# EAGLE design DRO (EAGLE 9.6.2)
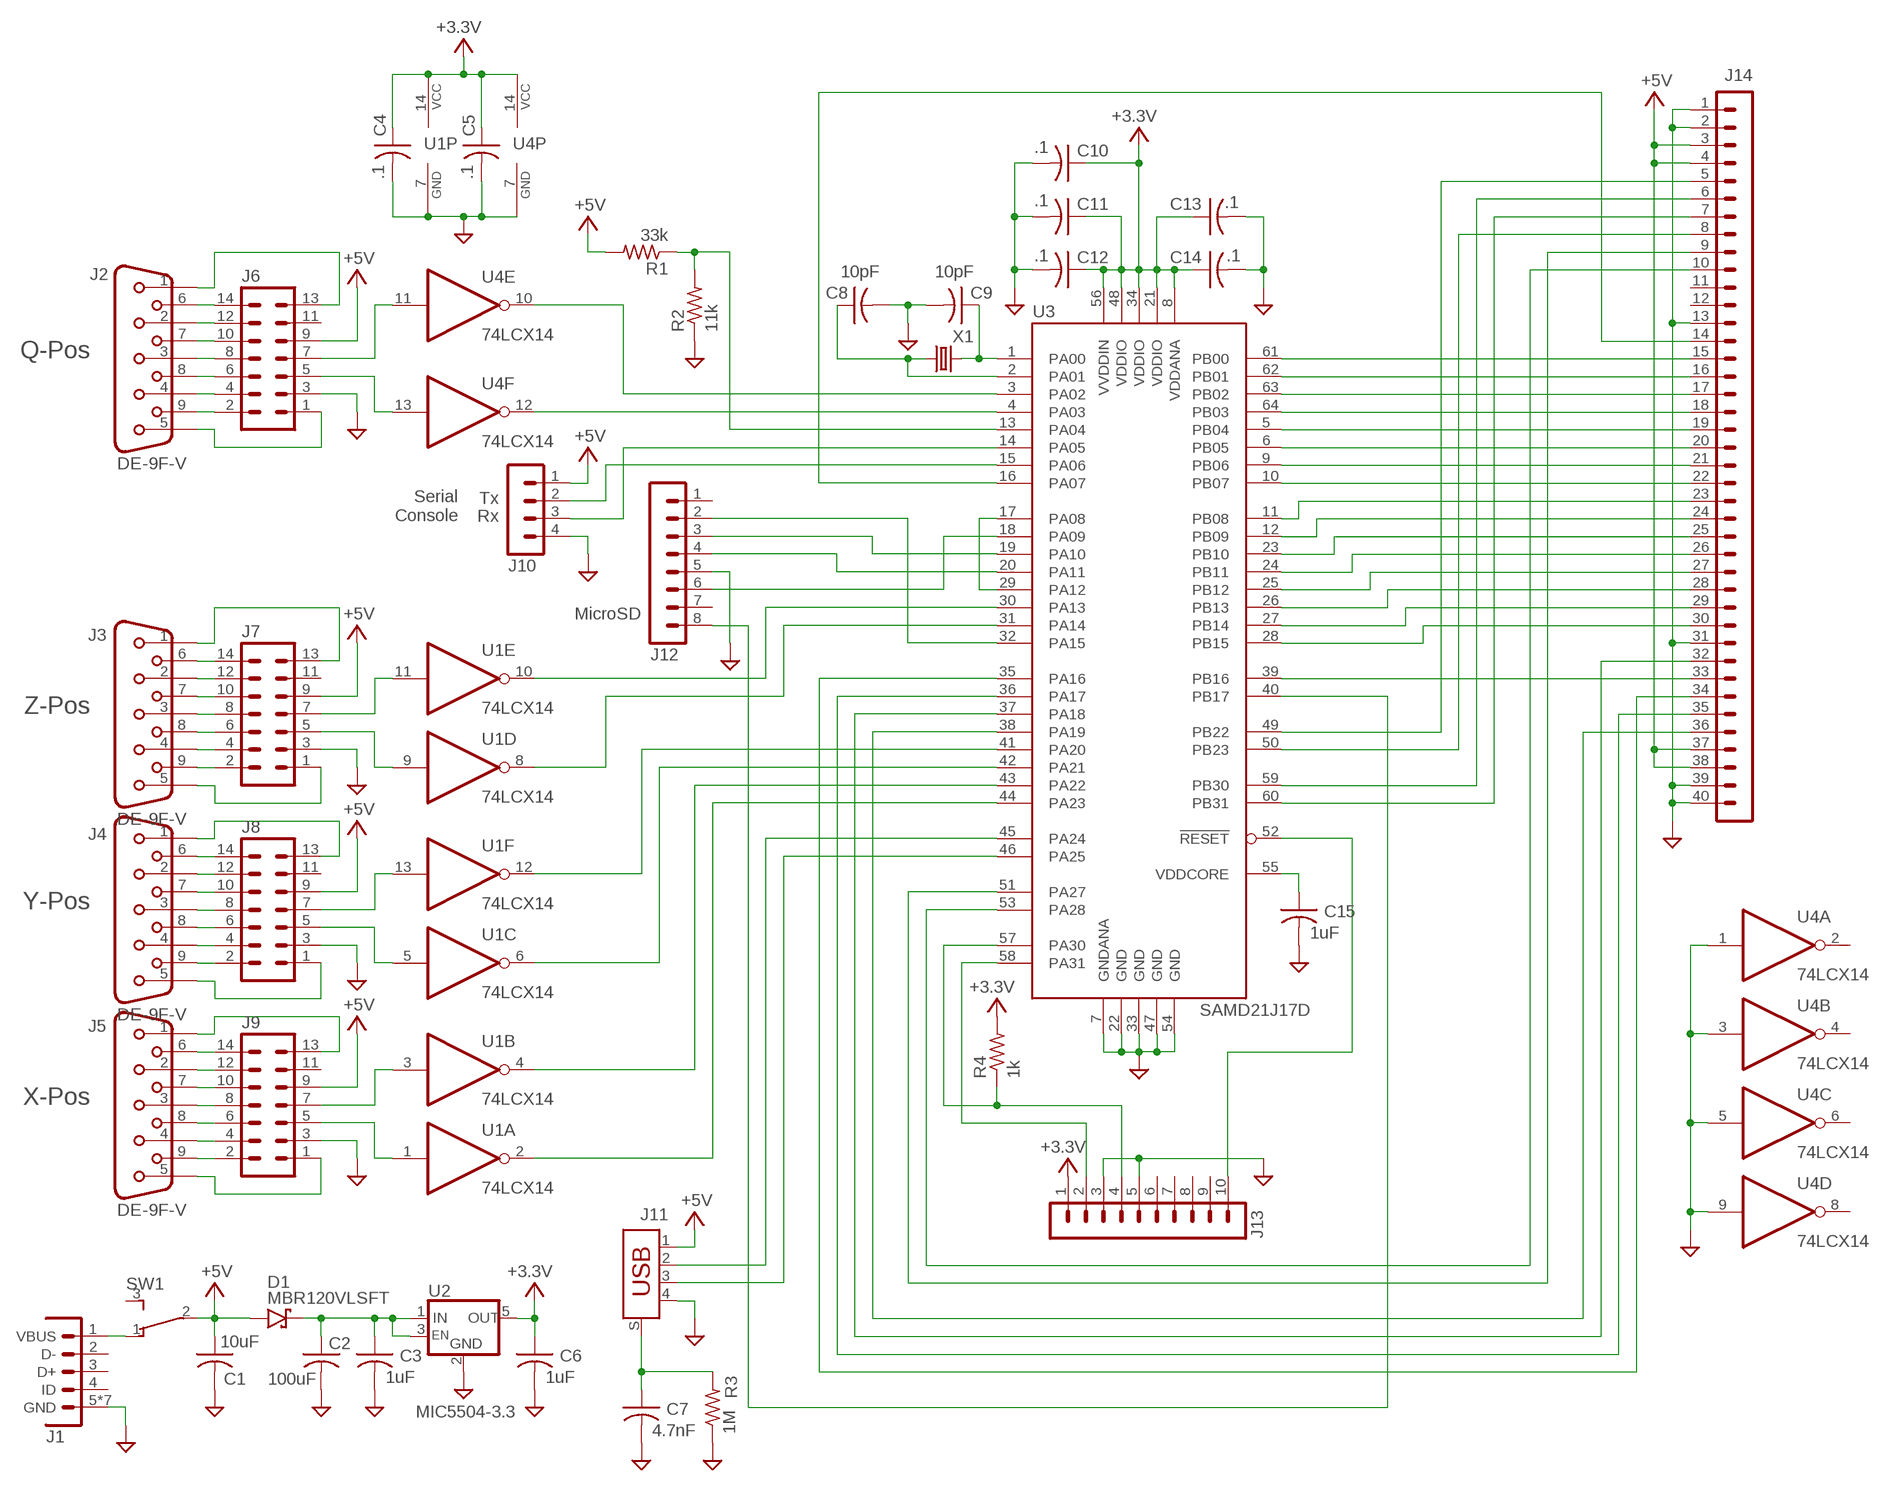
[diagram p0: schematic, sheet 1]

## Parts
C1  10uF  C-US0603  [0603]
C2  100uF  C-USC1206  [C1206]
C3  1uF  C-US0603  [0603]
C4  .1  C-US0603  [0603]
C5  .1  C-US0603  [0603]
C6  1uF  C-US0603  [0603]
C7  4.7nF  C-US0603  [0603]
C8  10pF  C-US0603  [0603]
C9  10pF  C-US0603  [0603]
C10  .1  C-US0603  [0603]
C11  .1  C-US0603  [0603]
C12  .1  C-US0603  [0603]
C13  .1  C-US0603  [0603]
C14  .1  C-US0603  [0603]
C15  1uF  C-US0603  [0603]
D1  MBR120VLSFT  SCHOTTKY-DIODE-SOD-123  [SOD123]
J1  USB_MINI-B-MICRO-B_FCI  [USB_MICRO-B_FCI]
J2  DE-9F-V  [DE-9F-PCB-VERT]
J3  DE-9F-V  [DE-9F-PCB-VERT]
J4  DE-9F-V  [DE-9F-PCB-VERT]
J5  DE-9F-V  [DE-9F-PCB-VERT]
J6  CONN-14-BIDI  [CONN-1.27X2-14]
J7  CONN-14-BIDI  [CONN-1.27X2-14]
J8  CONN-14-BIDI  [CONN-1.27X2-14]
J9  CONN-14-BIDI  [CONN-1.27X2-14]
J10  CONN-4-2.54X1-RA  [CONN-2.54X1-4-RA]
J11  USB-A-SHIELD  [USB-A]
J12  CONN-8-2.54X2  [CONN-2.54X2-8]
J13  CONN-10-ARM  [CONN-1.27X2-10]
J14  CONN-40  [CONN-2.54X2-40]
R1  33k  R-US0603  [0603]
R2  11k  R-US0603  [0603]
R3  1M  R-US0603  [0603]
R4  1k  R-US0603  [0603]
SW1  SWITCH-SPDT-MINI-RA-SHORT  [SWITCH-SPDT-MINI-RA-SHORT]
U1  74LCX14  7404M  [TSSOP14]
U2  MIC5504-3.3  VREG-ENABLE  [SOT23-5]
U3  SAMD21J17D  ATSAMD21JA  [TQFP64-0.5]
U4  74LCX14  7404M  [TSSOP14]
X1  CRYSTAL-3X1.5  [XTAL-SMD-3.2X1.5-2PIN]

## Nets
+3.3V: C4.1 C5.1 C6.1 C10.1 C11.1 C12.1 C13.1 C14.1 J13.1 R4.2 U1.14(P:VCC) U2.5(OUT) U3.8(VDDANA) U3.21(VDDIO) U3.34(VDDIO) U3.48(VDDIO) U3.56(VVDDIN) U4.14(P:VCC)
+5V: C1.1 D1.A J6.9 J7.9 J8.9 J9.9 J10.1 J11.1 J14.3 J14.4 J14.37 J14.38 R1.2 SW1.2(C)
GND: C1.2 C2.2 C3.2 C4.2 C5.2 C6.2 C7.2 C8.2 C9.2 C10.2 C11.2 C12.2 C13.2 C14.2 C15.2 J1.5(GND) J1.SHELL1(GND) J1.SHELL2(GND) J1.SHELL3(GND) J1.SHELL4(GND) J1.SHELL5(GND) J1.SHELL6(GND) J6.3 J7.3 J8.3 J9.3 J10.4 J11.4 J12.5 J13.3 J13.5 J14.1 J14.2 J14.13 J14.31 J14.39 J14.40 R2.1 R3.1 U1.7(P:GND) U2.2(GND) U3.7(GNDANA) U3.22(GND) U3.33(GND) U3.47(GND) U3.54(GND) U4.1(A:I) U4.3(B:I) U4.5(C:I) U4.7(P:GND) U4.9(D:I)
J1: J14.17 U3.63(PB02)
N$1: J14.15 U3.61(PB00)
N$2: J14.22 U3.10(PB07)
N$3: J14.23 U3.11(PB08)
N$4: J14.24 U3.12(PB09)
N$5: J14.25 U3.23(PB10)
N$6: J14.26 U3.24(PB11)
N$7: J14.27 U3.25(PB12)
N$8: J14.28 U3.26(PB13)
N$9: J14.29 U3.27(PB14)
N$10: J14.30 U3.28(PB15)
N$11: J14.16 U3.62(PB01)
N$12: J11.2 U3.45(PA24)
N$13: J14.18 U3.64(PB03)
N$14: J14.19 U3.5(PB04)
N$15: J14.20 U3.6(PB05)
N$16: J14.21 U3.9(PB06)
N$17: J11.3 U3.46(PA25)
N$18: U3.17(PA08) U3.29(PA12)
N$19: R1.1 R2.2 U3.13(PA04)
N$20: C9.1 U3.1(PA00) X1.2
N$21: C8.1 U3.2(PA01) X1.1
N$22: C2.1 C3.1 D1.C U2.1(IN) U2.3(EN)
N$23: J13.2 U3.58(PA31)
N$24: C15.1 U3.55(VDDCORE)
N$25: J13.4 R4.1 U3.57(PA30)
N$26: J14.33 U3.39(PB16)
N$27: J13.10 U3.52(!RESET)
N$28: J14.5 U3.49(PB22)
N$29: J14.8 U3.50(PB23)
N$30: J14.6 U3.59(PB30)
N$31: J14.7 U3.60(PB31)
N$32: J14.10 U3.53(PA28)
N$33: J14.9 U3.51(PA27)
N$34: J14.36 U3.38(PA19)
N$35: J14.32 U3.37(PA18)
N$36: J14.35 U3.36(PA17)
N$37: J14.34 U3.35(PA16)
N$38: J12.3 U3.19(PA10)
N$39: J14.14 U3.16(PA07)
N$40: J12.6 U3.18(PA09)
N$41: J12.4 U3.20(PA11)
N$42: J12.2 U3.32(PA15)
N$43: U1.10(E:O) U3.30(PA13)
N$44: J10.3 U3.14(PA05)
N$45: J10.2 U3.15(PA06)
N$46: U3.4(PA03) U4.12(F:O)
N$47: U3.3(PA02) U4.10(E:O)
N$48: J12.8 U3.40(PB17)
N$49: U1.8(D:O) U3.31(PA14)
N$50: U1.2(A:O) U3.44(PA23)
N$51: U1.4(B:O) U3.43(PA22)
N$52: U1.6(C:O) U3.42(PA21)
N$53: U1.12(F:O) U3.41(PA20)
N$54: J6.7 U4.11(E:I)
N$55: J6.5 U4.13(F:I)
N$56: J2.5 J6.1
N$57: J2.9 J6.2
N$58: J2.4 J6.4
N$59: J2.8 J6.6
N$60: J2.3 J6.8
N$61: J2.7 J6.10
N$62: J2.2 J6.12
N$63: J2.6 J6.14
N$64: J2.1 J6.13
N$65: J7.5 U1.9(D:I)
N$66: J8.5 U1.5(C:I)
N$67: J9.5 U1.1(A:I)
N$68: J9.7 U1.3(B:I)
N$69: J8.7 U1.13(F:I)
N$70: J7.7 U1.11(E:I)
N$71: J3.6 J7.14
N$72: J3.2 J7.12
N$73: J3.7 J7.10
N$74: J3.3 J7.8
N$75: J3.8 J7.6
N$76: J3.4 J7.4
N$77: J3.9 J7.2
N$78: J4.6 J8.14
N$79: J4.2 J8.12
N$80: J4.7 J8.10
N$81: J4.3 J8.8
N$82: J4.8 J8.6
N$83: J4.4 J8.4
N$84: J4.9 J8.2
N$85: J5.6 J9.14
N$86: J5.2 J9.12
N$87: J5.7 J9.10
N$88: J5.3 J9.8
N$89: J5.8 J9.6
N$90: J5.4 J9.4
N$91: J5.9 J9.2
N$92: J3.1 J7.13
N$93: J3.5 J7.1
N$94: J4.1 J8.13
N$95: J5.1 J9.13
N$96: J4.5 J8.1
N$97: J5.5 J9.1
N$98: C7.1 J11.S(SHIELD) R3.2
VBUS: J1.1(VBUS) SW1.1(NC)
Unconnected: J1.2(D-) J1.3(D+) J1.4(ID) J6.11 J7.11 J8.11 J9.11 J12.1 J12.7 J13.6 J13.7 J13.8 J13.9 J14.11 J14.12 SW1.3(NO) U4.2(A:O) U4.4(B:O) U4.6(C:O) U4.8(D:O)

## Notes on the sheet
- Q-Pos
- Serial
  Console
- Tx
- Rx
- MicroSD
- Z-Pos
- Y-Pos
- X-Pos

## Library data of the parts
C1-C15 = Tim's Parts:C-US: CAPACITOR, American symbol
D1 = Tim's Parts:SCHOTTKY-DIODE: Schottky Diode
J1 = Connectors:USB_MINI-B: USB mini-B or micro-B connector
J2-J5 = Connectors:DE-9: 9-pin SUB-D "F" variant for female "M" variant for male
J6-J9 = Connectors:CONN-14-BIDI
J10 = Connectors:CONN-4: PIN HEADER
J11 = Connectors:USB-A-SHIELD: AMP connector
J12 = Connectors:CONN-8
J13 = Connectors:CONN-10
J14 = Connectors:CONN-40
R1-R4 = Tim's Parts:R-US: RESISTOR, American symbol
SW1 = Tim's Parts:SWITCH-SPDT-MINI-RA: TINY SWITCH ON - MOM Source: http://www2.produktinfo.conrad.com/datenblaetter/700000-724999/705152-da-01-de-Subminiaturschalter_TL_36WO.pdf
U1 U4 = Tim's Parts:74*04: Hex INVERTER
U2 = Tim's Parts:VREG-ENABLE: Voltage regulator with enable input
U3 = Tim's Parts:ATSAMD21J
X1 = Tim's Parts:CRYSTAL: CRYSTAL

## Board
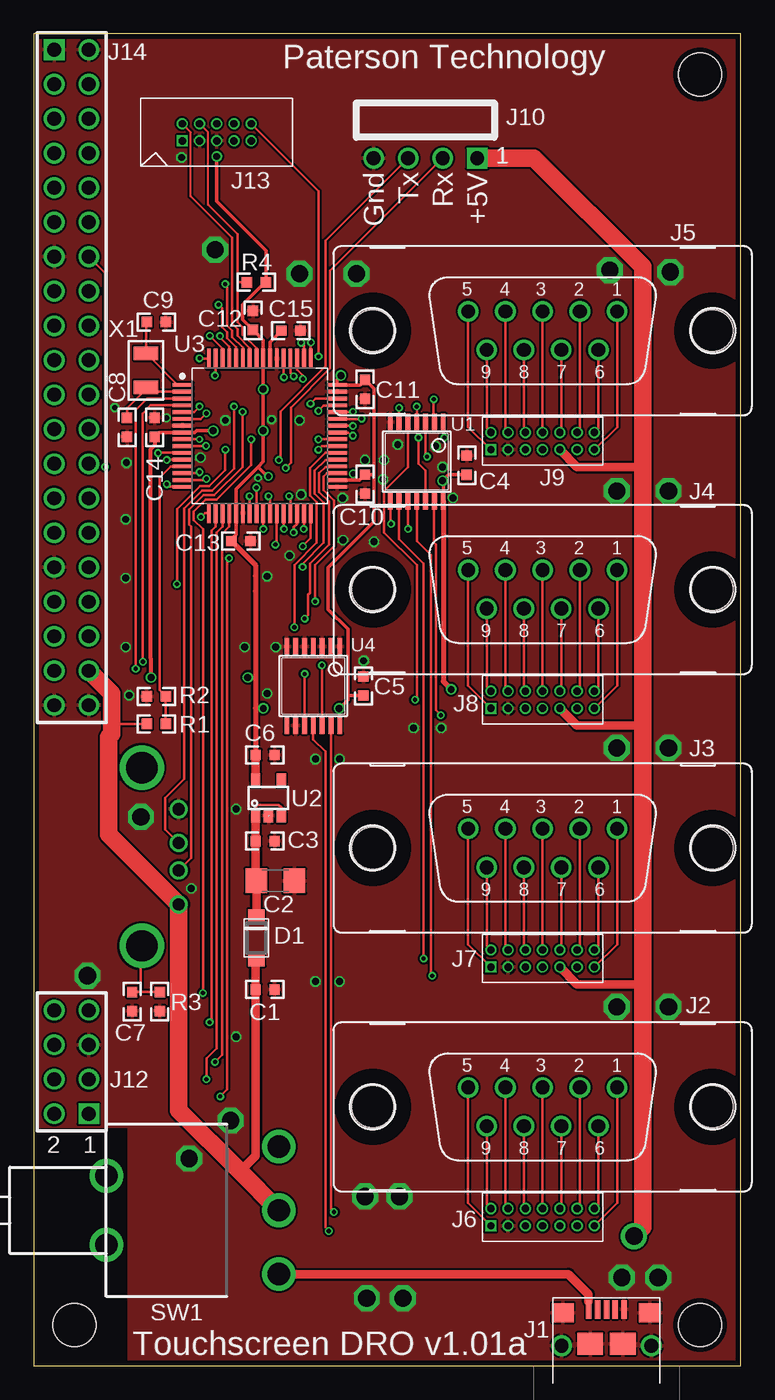
[diagram p1: board, top side]
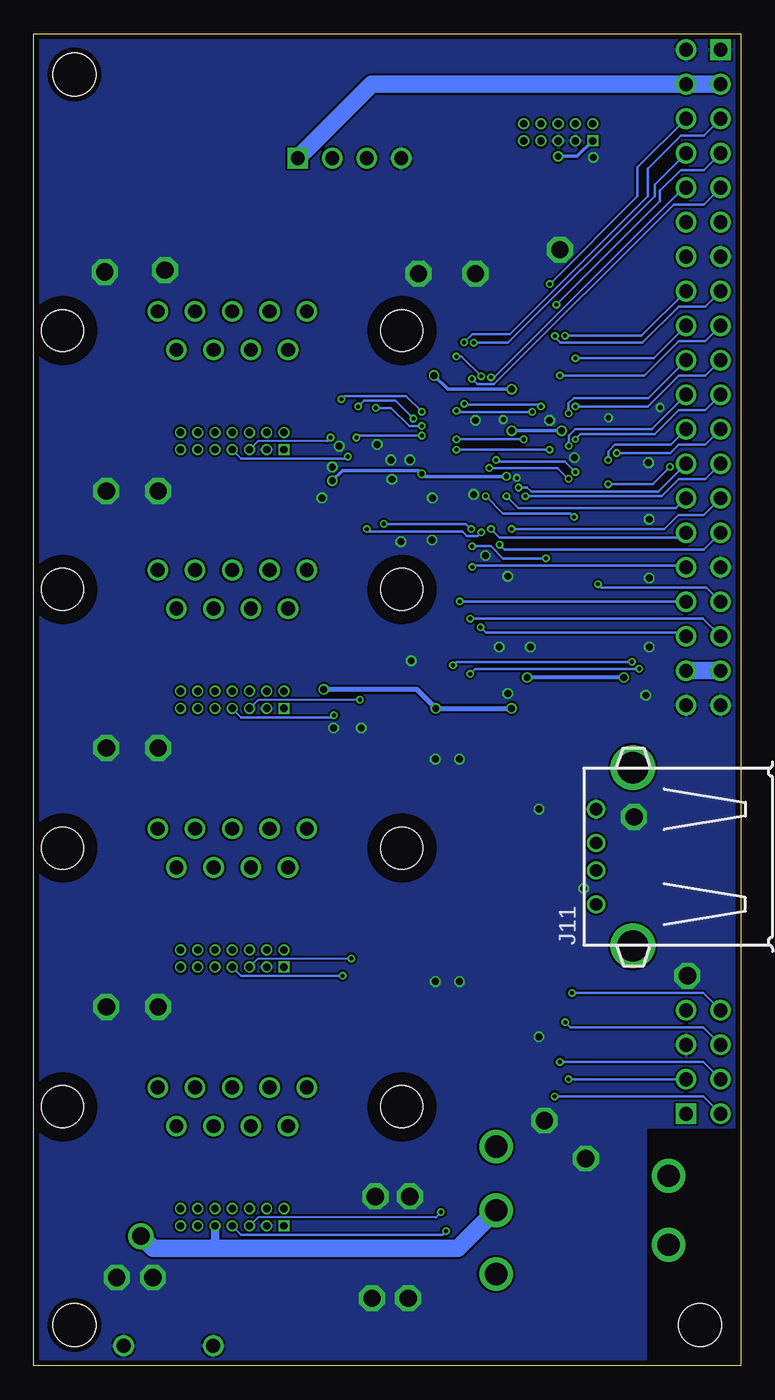
[diagram p2: board, bottom side, seen from below]

Size 52.07 x 98.04 mm. Coordinates in mm from the lower left corner, seen from the top.
Outline: 52.07,0 52.07,98.04 0,98.04 0,0 52.07,0
Copper layers (1*16): Top 0.035559375mm / dielectric 1.6mm / Bottom 0.035559375mm
Design rules "oshpark-2layer": minimum track width 6mil, minimum drill 10mil, track to track 6mil, track to pad 6mil, pad to pad 6mil, via to via 6mil, smd to smd 0mil, copper to edge 15mil, drill to drill 6mil, minimum pad ring 5mil, minimum via ring 5mil, stop-mask expansion 2.5mil, vias tented up to drill 0mil, thermal gap 6mil
Holes 3.17 mm at 3,3 49.07,3 49.07,95.05
tKeepout: area 0.2,0.2 to 5.8,5.8; area 46.3,0.2 to 51.9,5.8; area 46.3,92.3 to 51.9,97.8

### Footprints (pad centres in the part's own frame; a part is rotated, then mirrored left to right if it is on the bottom)
0603 = smd 0.76 x 0.76: 1 -0.7,0; 2 0.7,0
C1206 = smd 1.6 x 1.8: 1 -1.4,0; 2 1.4,0
SOD123 = smd 0.91 x 1.22: A 1.64,0; C -1.64,0
USB_MICRO-B_FCI = smd 0.4 x 1.35: 1 -1.3,4.125; 2 -0.65,4.125; 3 0,4.125; 4 0.65,4.125; 5 1.3,4.125 | smd 1.6 x 1.4: SHELL1 -3.2,3.9; SHELL2 3.2,3.9 | smd 1.9 x 1.6: SHELL3 -1.2,1.6; SHELL4 1.2,1.6 | drill 1.016: SHELL5 -3.3,1.45; SHELL6 3.3,1.45
DE-9F-PCB-VERT = drill 1.016: 1 5.486,1.422; 2 2.743,1.422; 3 0,1.422; 4 -2.743,1.422; 5 -5.486,1.422; 6 4.115,-1.422; 7 1.372,-1.422; 8 -1.372,-1.422; 9 -4.115,-1.422 | hole 3.099: -12.497,0; 12.497,0
CONN-1.27X2-14 = drill 0.542 square: 1 -1.905,-0.635 | drill 0.542: 2 -1.905,0.635; 3 -0.635,-0.635; 4 -0.635,0.635; 5 0.635,-0.635; 6 0.635,0.635; 7 1.905,-0.635; 8 1.905,0.635; 9 3.175,-0.635; 10 3.175,0.635; 11 4.445,-0.635; 12 4.445,0.635; 13 5.715,-0.635; 14 5.715,0.635
CONN-2.54X1-4-RA = drill 1.016 square: 1 0,0 | drill 1.016: 2 -2.54,0; 3 -5.08,0; 4 -7.62,0
USB-A = drill 0.889: 1 -3.5,0; 2 -1,0; 3 1,0; 4 3.5,0 | drill 2.286: S -6.553,-2.718; S1 6.553,-2.718
CONN-2.54X2-8 = drill 1.016 square: 1 0,0 | drill 1.016: 2 2.54,0; 3 0,-2.54; 4 2.54,-2.54; 5 0,-5.08; 6 2.54,-5.08; 7 0,-7.62; 8 2.54,-7.62
CONN-1.27X2-10 = drill 0.542 square: 1 -2.54,-0.635 | drill 0.542: 2 -2.54,0.635; 3 -1.27,-0.635; 4 -1.27,0.635; 5 0,-0.635; 6 0,0.635; 7 1.27,-0.635; 8 1.27,0.635; 9 2.54,-0.635; 10 2.54,0.635
CONN-2.54X2-40 = drill 1.016 square: 1 0,0 | drill 1.016: 2 2.54,0; 3 0,-2.54; 4 2.54,-2.54; 5 0,-5.08; 6 2.54,-5.08; 7 0,-7.62; 8 2.54,-7.62; 9 0,-10.16; 10 2.54,-10.16; 11 0,-12.7; 12 2.54,-12.7; 13 0,-15.24; 14 2.54,-15.24; 15 0,-17.78; 16 2.54,-17.78; 17 0,-20.32; 18 2.54,-20.32; 19 0,-22.86; 20 2.54,-22.86; 21 0,-25.4; 22 2.54,-25.4; 23 0,-27.94; 24 2.54,-27.94; 25 0,-30.48; 26 2.54,-30.48; 27 0,-33.02; 28 2.54,-33.02; 29 0,-35.56; 30 2.54,-35.56; 31 0,-38.1; 32 2.54,-38.1; 33 0,-40.64; 34 2.54,-40.64; 35 0,-43.18; 36 2.54,-43.18; 37 0,-45.72; 38 2.54,-45.72; 39 0,-48.26; 40 2.54,-48.26
SWITCH-SPDT-MINI-RA-SHORT = drill 1.651: 1 -4.699,-12.7; 2 0,-12.7; 3 4.699,-12.7; M1 -2.54,0; M2 2.54,0
TSSOP14 = smd 0.36 x 1.26: 1 -1.95,-2.9; 2 -1.3,-2.9; 3 -0.65,-2.9; 4 0,-2.9; 5 0.65,-2.9; 6 1.3,-2.9; 7 1.95,-2.9; 8 1.95,2.9; 9 1.3,2.9; 10 0.65,2.9; 11 0,2.9; 12 -0.65,2.9; 13 -1.3,2.9; 14 -1.95,2.9
SOT23-5 = smd 0.69 x 0.99: 1 -0.95,-1.29; 2 0,-1.29; 3 0.95,-1.29; 4 0.95,1.3; 5 -0.95,1.3
TQFP64-0.5 = smd 1.469 x 0.28: 1 -5.671,3.75; 2 -5.671,3.25; 3 -5.671,2.75; 4 -5.671,2.25; 5 -5.671,1.75; 6 -5.671,1.25; 7 -5.671,0.75; 8 -5.671,0.25; 9 -5.671,-0.25; 10 -5.671,-0.75; 11 -5.671,-1.25; 12 -5.671,-1.75; 13 -5.671,-2.25; 14 -5.671,-2.75; 15 -5.671,-3.25; 16 -5.671,-3.75; 33 5.671,-3.75; 34 5.671,-3.25; 35 5.671,-2.75; 36 5.671,-2.25; 37 5.671,-1.75; 38 5.671,-1.25; 39 5.671,-0.75; 40 5.671,-0.25; 41 5.671,0.25; 42 5.671,0.75; 43 5.671,1.25; 44 5.671,1.75; 45 5.671,2.25; 46 5.671,2.75; 47 5.671,3.25; 48 5.671,3.75 | smd 0.28 x 1.469: 17 -3.75,-5.671; 18 -3.25,-5.671; 19 -2.75,-5.671; 20 -2.25,-5.671; 21 -1.75,-5.671; 22 -1.25,-5.671; 23 -0.75,-5.671; 24 -0.25,-5.671; 25 0.25,-5.671; 26 0.75,-5.671; 27 1.25,-5.671; 28 1.75,-5.671; 29 2.25,-5.671; 30 2.75,-5.671; 31 3.25,-5.671; 32 3.75,-5.671; 49 3.75,5.671; 50 3.25,5.671; 51 2.75,5.671; 52 2.25,5.671; 53 1.75,5.671; 54 1.25,5.671; 55 0.75,5.671; 56 0.25,5.671; 57 -0.25,5.671; 58 -0.75,5.671; 59 -1.25,5.671; 60 -1.75,5.671; 61 -2.25,5.671; 62 -2.75,5.671; 63 -3.25,5.671; 64 -3.75,5.671
XTAL-SMD-3.2X1.5-2PIN = smd 1 x 1.8: 1 -1.25,0; 2 1.25,0

### Placement (x,y rotation side)
C1  17.02,27.69 0 top
C2  17.78,35.69 0 top
C3  17.02,38.61 0 top
C4  31.88,66.29 90 top
C5  24.26,50.04 90 top
C6  17.02,44.96 0 top
C7  7.24,26.8 270 top
C8  6.86,69.09 270 top
C9  9.02,76.83 0 top
C10  24.38,64.9 270 top
C11  24.38,71.88 270 top
C12  16.13,76.96 90 top
C13  15.24,60.71 0 top
C14  8.89,69.09 90 top
C15  18.92,76.2 0 top
D1  16.38,31.5 270 top
J1  42.16,0 0 top
J2  37.47,19.05 0 top
J3  37.47,38.1 0 top
J4  37.47,57.15 0 top
J5  37.47,76.2 0 top
J6  35.56,10.92 0 top
J7  35.56,29.97 0 top
J8  35.56,49.02 0 top
J9  35.56,68.07 0 top
J10  32.64,88.9 0 top
J11  10.67,37.47 90 bottom
J12  4.04,18.54 180 top
J13  13.46,90.81 0 top
J14  1.5,96.88 0 top
R1  9.02,47.24 180 top
R2  9.02,49.28 0 top
R3  9.27,26.8 90 top
R4  16.38,79.76 0 top
SW1  5.33,11.43 90 top
U1  28.19,66.55 180 top
U2  17.27,41.78 0 top
U3  16.64,68.45 0 top
U4  20.57,50.04 180 top
X1  8.26,73.28 90 top

### Tracks (layer width: path | path; a pad name or v marks a point on that pad's centre or on a via)
+3.3V  (via drill 0.38, 0.51)
  Top 0.254: U3.34 23.5,65.2 | 23.5,65.2 23.99,65.2 C10.1 24.98,65.6 25.04,65.53 | C13.1 14.54,60.83 14.89,61.18 U3.21 14.89,64.54 16.51,66.17 | C14.1 9.21,68.7 U3.8 10.99,68.68 11.84,68.68 11.99,68.83 v13.2,68.83 | 16.51,66.17 16.89,66.54 v16.89,68.83 v16.89,71.88 U3.56 16.89,75.5 C12.1 15.37,77.02 15.37,78.11 17.02,79.76 R4.2 17.08,82.1 13.46,85.72 v13.46,89.03 | v22.61,72.9 22.31,72.6 U3.48 24,72.2 C11.1 25.04,71.92 25.04,65.53 | U4.14 22.52,48.34 | U1.14 30.14,65.11 v30.1,65.15 30.54,65.59 C4.1 | v22.48,48.39 23.11,49.02 23.11,49.4 | 23.11,49.4 23.11,54.23 21.67,55.68 21.67,58.75 25.04,62.13 25.04,65.53 | C5.1 23.18,49.34 23.11,49.4 | 23.5,65.2 23.5,65.64 v23.51,65.66 | v17.27,65.47 17.21,65.47 16.51,66.17
  Top 0.305: C14.1 8.89,67.75 8.56,67.42 8.56,52.11 8.61,52.06 8.61,50.67 v8.62,50.66 | 22.52,48.34 v22.48,48.39 | v15.75,50.66 15.76,50.67 16.32,50.67
  Top 0.381: C13.1 16.32,58.92 16.32,58.17 16.32,57.02 16.32,50.67 16.32,48.39 | 16.32,48.39 C6.1 | v16.89,48.39 16.32,48.39 | U1.14 30.14,50.37 v30.73,49.78
  Top 0.635: U2.5 C6.1
  Bottom 0.254: v13.2,68.83 v16.88,68.83 v16.89,68.83 | v22.61,72.9 21.59,71.88 v16.89,71.88 | v17.27,65.47 23.32,65.47 v23.51,65.66 23.77,65.91 29.34,65.91 v30.1,65.15 | v13.46,89.03 12.06,89.03 J13.1
  Bottom 0.305: v8.62,50.66 v15.75,50.66
  Bottom 0.381: v16.89,48.39 v22.48,48.39 23.88,49.78 v30.73,49.78
+5V  (via drill 1.27)
  Top 0.178: R1.2 5.71,47.24
  Top 0.635: 15.18,14.29 16.32,15.43 C1.1 16.32,29.79 D1.A | J7.9 40.01,28.07 44.83,28.07 | J8.9 40.01,47.12 44.83,47.12 | J9.9 40.01,66.17 44.7,66.17 44.83,66.29
  Top 1.27: SW1.2 15.18,14.29 10.67,18.8 J11.1 5.51,39.12 5.51,46.3 5.71,46.5 5.71,47.24 5.71,49.48 J14.38 | J10.1 36.83,88.9 44.83,80.9 44.83,66.29 44.83,47.12 44.83,28.07 44.83,10.16 v44.2,9.53
  Bottom 0.635: J6.9 38.73,8.76 38.61,8.64
  Bottom 1.27: J14.38 J14.37 | J10.1 27.2,94.34 J14.4 J14.3 | SW1.2 20.83,8.64 38.61,8.64 43.31,8.64 v44.2,9.53
GND  (via drill 0.3, 0.38, 0.51, 1.27)
  other vias: 9.75,69.77 5.94,70.54 16.51,65.35 22.73,63.88 19.68,64.14 25.7,65.25 25.78,66.67 24.38,66.67 30.1,66.17 30.86,63.88 22.76,60.78 18.82,59.64 25.04,60.66 6.76,57.99 14.1,69.6 19.56,69.6 17.5,69.65 12.27,66.85 6.81,66.47 17.17,58.12 10.87,88.95 30,46.94 27.97,46.94 22.5,44.65 20.73,44.65 22.5,28.27 20.73,28.27 14.88,24.21 14.88,40.97 7.01,49.35 11.58,35.13 43.31,6.48 24.51,4.95 27.18,4.95 24.38,12.45 26.92,12.45 45.97,6.48 14.48,18.03 11.43,15.24 3.94,28.7 7.87,40.39 13.34,82.17 6.76,62.31 6.76,52.91 17.81,52.91 17.17,49.48 24.28,51.89 26.8,67.82 29.59,67.69 19.56,80.39 23.75,80.39 42.42,80.64 46.86,80.52 46.74,64.39 42.93,64.39 42.93,45.47 46.74,45.47 42.93,26.42 46.74,26.42 15.52,52.91
  pour Top: 0.25,97.79 51.94,97.79 51.94,0.13 6.99,0.13 6.99,17.53 0.25,17.53
  pour Bottom: 0.25,97.79 51.94,97.79 51.94,96.9 51.94,0.13 6.99,0.13 6.99,0.25 6.99,17.53 6.86,17.53 0.25,17.53
J1  (via drill 0.3)
  Top 0.178: U3.63 13.39,72.95 v13.34,72.9
  Bottom 0.178: v13.34,72.9 7.11,72.9 4.57,75.44 2.62,75.44 J14.17
N$1  (via drill 0.3)
  Top 0.178: U3.61 14.39,75.02 13.7,75.7 v13.7,75.81
  Bottom 0.178: J14.15 2.62,77.98 4.57,77.98 7.25,75.3 13.3,75.3 13.7,75.7 v13.7,75.81
N$2  (via drill 0.3)
  Top 0.178: U3.10 12.67,67.7 v12.68,67.71
  Bottom 0.178: v12.68,67.71 12.68,67.98 12.69,67.99 12.69,68.47 12.19,68.96 6.56,68.96 J14.22
N$3  (via drill 0.3)
  Top 0.178: U3.11 9.16,67.2 v9.14,67.18
  Bottom 0.178: v9.14,67.18 5.21,67.18 4.57,67.82 2.62,67.82 J14.23
N$4  (via drill 0.3)
  Top 0.178: U3.12 9.81,66.7 v9.78,66.67
  Bottom 0.178: J14.24 5.16,67.82 9.27,67.82 9.78,67.31 v9.78,66.67
N$5  (via drill 0.3)
  Top 0.178: U3.23 15.89,64 v15.88,64.01
  Bottom 0.178: v15.88,64.01 5.84,64.01 4.57,65.28 2.62,65.28 J14.25
N$6  (via drill 0.3)
  Top 0.178: U3.24 16.39,63.78 16.4,63.79 16.4,64.63 v16.38,64.64
  Bottom 0.178: v16.38,64.64 15.75,64.64 15.44,64.34 6.1,64.34 J14.26
N$7  (via drill 0.3)
  Top 0.178: U3.25 v16.89,61.59
  Bottom 0.178: J14.27 2.75,62.61 4.6,62.61 5.63,61.58 16.88,61.58 v16.89,61.59
N$8  (via drill 0.3)
  Top 0.178: U3.26 17.39,63.89 v17.27,64.01
  Bottom 0.178: v17.27,64.01 16.38,63.12 4.78,63.12 J14.28
N$9  (via drill 0.3)
  Top 0.178: U3.27 17.89,60.55 v17.78,60.44
  Bottom 0.178: v17.78,60.44 17.41,60.07 2.75,60.07 J14.29
N$10  (via drill 0.3)
  Top 0.178: U3.28 18.39,61.62 v18.41,61.59
  Bottom 0.178: v18.41,61.59 17.78,60.96 4.4,60.96 J14.30
N$11  (via drill 0.3)
  Top 0.178: U3.62 13.89,74.89 v12.95,75.82
  Bottom 0.178: v12.95,75.82 7.32,75.82 J14.16
N$12  (via drill 0.3)
  Top 0.178: v20.95,70.3 21.34,70.68 21.9,70.68 21.93,70.7 U3.45 | v15.37,70.22 15.37,66.17 13.29,64.09 12.5,64.09 11.43,63.02 11.43,61.93 11.58,61.79 11.58,37.37 J11.2
  Bottom 0.178: v15.37,70.22 20.88,70.22 v20.95,70.3
N$13  (via drill 0.3)
  Top 0.178: U3.64 12.24,74.12 v12.19,74.17
  Bottom 0.178: v12.19,74.17 6.43,74.17 J14.18
N$14  (via drill 0.3)
  Top 0.178: U3.5 11.78,70.2 v12.19,70.61
  Bottom 0.178: v12.19,70.61 6.86,70.61 4.57,72.9 2.62,72.9 J14.19
N$15  (via drill 0.3)
  Top 0.178: U3.6 12.29,69.7 v12.7,70.11
  Bottom 0.178: v12.7,70.11 12.71,70.11 12.71,70.85 12.32,71.25 6.81,71.25 J14.20
N$16  (via drill 0.25)
  Top 0.178: U3.9 v12.19,68.2
  Bottom 0.178: v12.19,68.2 11.81,68.58 6.35,68.58 4.57,70.36 2.62,70.36 J14.21
N$17  (via drill 0.3)
  Top 0.178: v20.37,70.81 20.75,71.2 U3.46 | v14.73,70.61 14.73,66.04 13.12,64.43 12.38,64.43 11.05,63.1 11.05,43.18 9.65,41.78 9.65,39.48 J11.3
  Bottom 0.178: v14.73,70.61 14.86,70.74 20.29,70.74 v20.37,70.81
N$18  (via drill 0.3)
  Top 0.178: U3.29 18.89,63.92 v18.8,64.01 | v12.29,62.48 12.59,62.78 U3.17
  Bottom 0.178: v18.8,64.01 17.53,62.74 12.55,62.74 v12.29,62.48
N$19
  Top 0.178: U3.13 10.07,66.2 9.25,65.38 9.25,49.75 R2.2 R1.1
N$20
  Top 0.178: U3.1 10.58,72.2 X1.2 8.26,76.77 C9.1
N$21
  Top 0.178: U3.2 8.58,71.7 8.33,71.96 | 8.33,71.96 X1.1 | C8.1 6.86,70.48 8.33,71.96
N$22
  Top 0.178: U2.1 16.32,41.09 16.51,41.27 18.03,41.27 18.22,41.09 U2.3
  Top 0.635: D1.C C2.1 16.32,35.75 C3.1 U2.1
N$23
  Top 0.152: J13.2 11.56,90.81 11.56,86.11
  Top 0.178: U3.58 15.89,74.92 14.99,75.82 14.99,76.33 14.61,76.71 14.61,83.06 11.56,86.11
N$24
  Top 0.254: U3.55 17.39,75.36 C15.1
N$25
  Top 0.152: J13.4 12.83,90.81 12.83,85.47
  Top 0.178: U3.57 16.39,74.9 15.37,75.92 15.37,76.45 14.99,76.83 14.99,79.76 | 14.99,79.76 14.99,83.31 12.83,85.47 | R4.1 14.99,79.76
N$26  (via drill 0.3)
  Top 0.178: U3.39 21.22,67.7 v20.95,67.44 | v14.1,67.44 14.1,65.95 12.91,64.76 12.24,64.76 10.53,63.05 v10.53,57.53
  Bottom 0.178: v20.95,67.44 v14.1,67.44 | J14.33 2.54,57.28 10.27,57.28 v10.53,57.53
N$27  (via drill 0.3)
  Top 0.178: U3.52 18.89,73.09 v19.13,72.85 | J13.10 20.96,86.48 v20.96,74.3
  Bottom 0.178: v19.13,72.85 20.57,74.3 v20.96,74.3
N$28  (via drill 0.3)
  Top 0.178: U3.49 20.39,75.33 v20.4,75.34
  Bottom 0.178: v20.4,75.34 19.79,75.95 17.02,75.95 6.86,86.11 6.86,88.14 4.45,90.55 2.75,90.55 J14.5
N$29  (via drill 0.3)
  Top 0.178: U3.50 19.89,75.11 v19.68,75.31
  Bottom 0.178: v19.68,75.31 17.14,75.31 6.35,86.11 6.35,86.95 J14.8
N$30  (via drill 0.3)
  Top 0.178: U3.59 15.39,74.95 14.61,75.73 14.61,76.2 14.22,76.58 14.22,79.49 v14.08,79.63
  Bottom 0.178: v14.08,79.63 7.62,86.1 7.62,88.22 J14.6
N$31  (via drill 0.3)
  Top 0.178: U3.60 14.89,74.98 14.22,75.65 14.22,76.07 13.84,76.45 13.84,77.85 v13.59,78.11
  Bottom 0.178: v13.59,78.11 5.97,85.72 5.97,86.49 4.45,88.01 2.75,88.01 J14.7
N$32  (via drill 0.3)
  Top 0.178: U3.53 18.39,72.8 v18.41,72.77
  Bottom 0.178: v18.41,72.77 18.16,72.77 4.21,86.72 J14.10
N$33  (via drill 0.3)
  Top 0.178: U3.51 19.39,73.32 19.81,72.9 v19.81,72.64
  Bottom 0.178: J14.9 2.75,85.47 4.95,85.47 18.17,72.25 19.42,72.25 v19.81,72.64
N$34  (via drill 0.3)
  Top 0.178: U3.38 21.48,67.2 20.34,66.06 20.34,64.05 20.83,63.57 20.83,60.58 19.18,58.93 v19.18,54.36
  Bottom 0.178: J14.36 4.32,53.98 18.8,53.98 v19.18,54.36
N$35  (via drill 0.3)
  Top 0.178: U3.37 22.28,66.67 21.46,66.67 20.67,65.88 20.67,64.19 21.31,63.55 21.34,63.52 21.34,60.58 19.79,59.03 v19.79,58.8
  Bottom 0.178: J14.32 4.17,58.91 19.68,58.91 v19.79,58.8
N$36  (via drill 0.3)
  Top 0.178: U3.36 22.27,66.17 21.46,66.17 21,65.71 21,64.33 21.72,63.61 21.72,60.45 20.32,59.05 20.32,56.9 20.19,56.77 20.19,55.24 v19.94,54.99
  Bottom 0.178: J14.35 2.79,54.99 17.78,54.99 v19.94,54.99
N$37  (via drill 0.3)
  Top 0.178: U3.35 21.59,65.7 21.33,65.44 21.33,64.46 22.11,63.69 22.11,60.33 20.71,58.93 v20.71,56.26
  Bottom 0.178: J14.34 15.24,56.24 20.69,56.24 v20.71,56.26
N$38  (via drill 0.3)
  Top 0.178: U3.19 13.89,61.77 13.46,61.34 13.46,23.37 12.7,22.61 v12.7,21.08
  Bottom 0.178: v12.7,21.08 J12.3
N$39  (via drill 0.3)
  Top 0.178: U3.16 9.97,64.7 v9.78,64.9 | v5.23,66.17 5.23,80.45 J14.14
  Bottom 0.178: v9.78,64.9 6.5,64.9 v5.23,66.17
N$40  (via drill 0.3)
  Top 0.178: U3.18 13.39,61.77 13.08,61.47 13.08,25.41 v12.94,25.27
  Bottom 0.178: v12.94,25.27 12.56,24.89 2.77,24.89 J12.6
N$41  (via drill 0.3)
  Top 0.178: U3.20 14.39,61.76 13.84,61.21 13.84,22.86 v13.34,22.35
  Bottom 0.178: J12.4 2.77,22.35 v13.34,22.35
N$42  (via drill 0.3)
  Top 0.178: v13.72,19.81 14.22,20.32 14.22,59.3 v14.36,59.44 | v19.8,60.33 20.39,60.91 U3.32
  Bottom 0.178: J12.2 2.77,19.81 v13.72,19.81 | v19.8,60.33 18.4,60.33 17.51,59.44 v14.36,59.44
N$43  (via drill 0.3)
  Top 0.178: U3.30 19.37,62.77 19.37,61.97 19.13,61.72 v19.13,61.34 | v27.56,61.59 27.54,61.61 U1.10
  Bottom 0.178: v27.56,61.59 27.38,61.42 20.52,61.42 20.17,61.06 19.41,61.06 v19.13,61.34
N$44  (via drill 0.3)
  Top 0.178: U3.14 12.11,65.7 v12.19,65.79 | v18.03,66.67 18.16,66.8 18.16,70.26 21.49,73.58 21.49,82.83 J10.3
  Bottom 0.178: v12.19,65.79 12.95,66.55 17.91,66.55 v18.03,66.67
N$45  (via drill 0.3)
  Top 0.178: v12.7,65.28 12.62,65.2 U3.15 | v18.54,66.09 18.92,66.47 18.92,70.54 21.82,73.43 21.82,80.62 J10.2
  Bottom 0.178: v12.7,65.28 13.5,66.09 v18.54,66.09
N$46  (via drill 0.3)
  Top 0.178: U3.4 8.6,70.7 8,70.1 8,51.84 v8.03,51.82 | v21.21,51.56 21.22,51.55 U4.12
  Bottom 0.178: v21.21,51.56 20.95,51.82 v8.03,51.82
N$47  (via drill 0.3)
  Top 0.178: U3.3 8.34,71.2 7.49,70.36 v7.49,51.31 | v19.94,50.93 19.94,47.15 U4.10
  Bottom 0.178: v7.49,51.31 7.54,51.31 7.57,51.28 19.58,51.28 v19.94,50.93
N$48  (via drill 0.3)
  Top 0.178: U3.40 v20.96,68.2 v20.95,68.2 | v16,68.2 16,66.29 13.47,63.76 12.64,63.76 11.77,62.89 11.77,62.27 12.45,61.59 v12.45,27.43
  Bottom 0.178: v20.95,68.2 v16,68.2 | J12.8 2.77,27.43 v12.45,27.43
N$49  (via drill 0.3)
  Top 0.178: U3.31 19.89,61.62 v19.87,61.59 | v26.3,61.98 26.24,62.03 U1.8
  Bottom 0.178: v19.87,61.59 20.25,61.98 v26.3,61.98
N$50  (via drill 0.3)
  Top 0.178: U3.44 23.47,70.2 v23.5,70.23 | v29.44,71.14 29.44,69.5 U1.2
  Bottom 0.178: v23.5,70.23 24.65,71.39 29.2,71.39 v29.44,71.14
N$51  (via drill 0.3)
  Top 0.178: U3.43 24.11,69.7 v24.13,69.72 | v28.19,70.61 U1.4
  Bottom 0.178: v24.13,69.72 25.45,71.04 27.76,71.04 v28.19,70.61
N$52  (via drill 0.3)
  Top 0.178: U3.42 23.47,69.2 v23.5,69.18 | v26.9,70.51 v26.89,70.51 U1.6
  Bottom 0.178: v26.9,70.51 25.76,70.51 24.43,69.18 v23.5,69.18
N$53  (via drill 0.3)
  Top 0.178: U3.41 23.12,68.7 23.35,68.47 v23.5,68.47 | v28.32,68.33 28.32,66.42 28.84,65.9 U1.12
  Bottom 0.178: v23.5,68.47 28.18,68.47 v28.32,68.33
N$54  (via drill 0.3)
  Top 0.178: U4.11 20.57,46.1 21.46,45.21 21.46,10.16 v21.72,9.91
  Bottom 0.178: J6.7 36.8,9.63 22,9.63 v21.72,9.91
N$55  (via drill 0.3)
  Top 0.178: U4.13 21.87,11.53 v22.1,11.3
  Bottom 0.152: J6.5 35.56,10.92 22.48,10.92
  Bottom 0.178: v22.1,11.3 22.48,10.92
N$56
  Top 0.178: J2.5 31.98,11.96 J6.1
N$57
  Top 0.178: J2.9 33.35,11.86 J6.2
N$58
  Top 0.178: J2.4 34.72,11.76 J6.4
N$59
  Top 0.178: J2.8 36.09,11.66 J6.6
N$60
  Top 0.178: J2.3 J6.8
N$61
  Top 0.178: J2.7 38.84,11.66 J6.10
N$62
  Top 0.178: J2.2 40.21,11.76 J6.12
N$63
  Top 0.178: J2.6 41.58,11.86 J6.14
N$64
  Top 0.178: J2.1 42.95,11.96 J6.13
N$65  (via drill 0.3)
  Top 0.178: U1.9 26.89,60.86 28.7,59.05 28.7,44.83 28.7,44.7 v28.7,29.97
  Bottom 0.152: J7.5 35.56,29.97 v28.7,29.97
N$66  (via drill 0.3)
  Top 0.178: U1.5 27.54,66.15 25.78,64.39 25.78,61.34 28.19,58.93 28.19,49.15 v28.07,49.02
  Bottom 0.152: J8.5 35.56,49.02 v28.07,49.02
N$67  (via drill 0.3)
  Top 0.178: U1.1 30.14,68.41 v30.23,68.33
  Bottom 0.152: J9.5 35.56,68.07 30.48,68.07
  Bottom 0.178: v30.23,68.33 30.48,68.07
N$68  (via drill 0.3)
  Top 0.178: U1.3 28.84,67.04 v28.96,66.93
  Bottom 0.178: v28.96,66.93 29.1,66.79 36.82,66.79 J9.7
N$69  (via drill 0.3)
  Top 0.178: v29.97,47.88 29.59,48.26 29.59,60.45 29.46,60.58 29.46,63.62 U1.13
  Bottom 0.178: J8.7 36.8,47.73 30.12,47.73 v29.97,47.88
N$70  (via drill 0.3)
  Top 0.178: U1.11 28.19,60.71 29.23,59.66 29.23,28.8 v29.34,28.7
  Bottom 0.178: v29.34,28.7 29.36,28.68 36.8,28.68 J7.7
N$71
  Top 0.178: J3.6 41.58,30.91 J7.14
N$72
  Top 0.178: J3.2 40.21,30.81 J7.12
N$73
  Top 0.178: J3.7 38.84,30.71 J7.10
N$74
  Top 0.178: J3.3 J7.8
N$75
  Top 0.178: J3.8 36.09,30.71 J7.6
N$76
  Top 0.178: J3.4 34.72,30.81 J7.4
N$77
  Top 0.178: J3.9 33.35,30.91 J7.2
N$78
  Top 0.178: J4.6 41.58,49.96 J8.14
N$79
  Top 0.178: J4.2 40.21,49.86 J8.12
N$80
  Top 0.178: J4.7 38.84,49.76 J8.10
N$81
  Top 0.178: J4.3 J8.8
N$82
  Top 0.178: J4.8 36.09,49.76 J8.6
N$83
  Top 0.178: J4.4 34.72,49.86 J8.4
N$84
  Top 0.178: J4.9 33.35,49.96 J8.2
N$85
  Top 0.178: J5.6 41.58,69.01 J9.14
N$86
  Top 0.178: J5.2 40.21,68.91 J9.12
N$87
  Top 0.178: J5.7 38.84,68.81 J9.10
N$88
  Top 0.178: J5.3 J9.8
N$89
  Top 0.178: J5.8 36.09,68.81 J9.6
N$90
  Top 0.178: J5.4 34.72,68.91 J9.4
N$91
  Top 0.178: J5.9 33.35,69.01 J9.2
N$92
  Top 0.178: J3.1 42.95,31.01 J7.13
N$93
  Top 0.178: J3.5 31.98,31.01 J7.1
N$94
  Top 0.178: J4.1 42.95,50.06 J8.13
N$95
  Top 0.178: J5.1 42.95,69.11 J9.13
N$96
  Top 0.178: J4.5 31.98,50.06 J8.1
N$97
  Top 0.178: J5.5 31.98,69.11 J9.1
N$98
  Top 0.178: C7.1 7.87,27.5 | 7.87,27.5 R3.2 | 7.87,27.5 7.87,30.84 J11.S
VBUS
  Top 0.305: J1.1 40.84,4.14 40.84,4.7
  Top 0.635: SW1.1 39.37,6.73 40.84,5.26 40.84,4.7

### Text on the board
tPlace: Paterson Technology | Gnd | Tx | Rx | +5V | Touchscreen DRO v1.01a